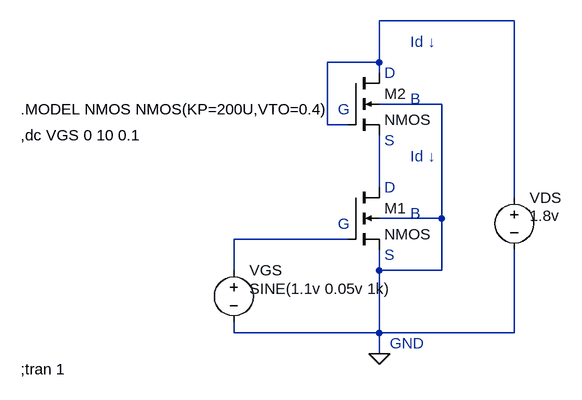
[diagram p0: schematic NMOS-NMOS.asc]
NMOS-NMOS.asc, the LTspice schematic file:
Version 4
SHEET 1 880 680
WIRE 336 -192 128 -192
WIRE 128 -128 128 -192
WIRE 128 -128 48 -128
WIRE 128 -112 128 -128
WIRE 224 -64 128 -64
WIRE 48 -32 48 -128
WIRE 80 -32 48 -32
WIRE 128 64 128 -16
WIRE 336 80 336 -192
WIRE 224 112 224 -64
WIRE 224 112 128 112
WIRE 80 144 -96 144
WIRE -96 192 -96 144
WIRE 128 192 128 160
WIRE 224 192 224 112
WIRE 224 192 128 192
WIRE -96 288 -96 272
WIRE 128 288 128 192
WIRE 128 288 -96 288
WIRE 336 288 336 160
WIRE 336 288 128 288
WIRE 128 320 128 288
FLAG 128 320 0
SYMBOL nmos4 80 64 R0
SYMATTR InstName M1
SYMATTR Value2 l=1u w=100u
SYMBOL voltage 336 64 R0
WINDOW 3 24 44 Left 2
WINDOW 123 0 0 Left 0
WINDOW 39 0 0 Left 0
SYMATTR Value 1.8v
SYMATTR InstName VDS
SYMBOL voltage -96 176 R0
WINDOW 3 24 44 Left 2
WINDOW 123 0 0 Left 0
WINDOW 39 0 0 Left 0
SYMATTR Value SINE(1.1v 0.05v 1k)
SYMATTR InstName VGS
SYMBOL nmos4 80 -112 R0
SYMATTR InstName M2
SYMATTR Value2 l=1u w=10u
TEXT 136 64 Left 2 ;D
TEXT 64 120 Left 2 ;G
TEXT 136 168 Left 2 ;S
TEXT 176 104 Left 2 ;B
TEXT 144 304 Left 2 ;GND
TEXT 176 16 Left 2 ;Id ↓
TEXT -424 -56 Left 2 !.MODEL NMOS NMOS(KP=200U,VTO=0.4)
TEXT -424 344 Left 2 !;tran 1
TEXT 136 -112 Left 2 ;D
TEXT 64 -56 Left 2 ;G
TEXT 136 -8 Left 2 ;S
TEXT 176 -72 Left 2 ;B
TEXT 176 -160 Left 2 ;Id ↓
TEXT -424 -16 Left 2 !,dc VGS 0 10 0.1

The netlist it stands for:
* NMOS-NMOS.asc
M1 N002 N003 0 0 NMOS l=1u w=100u
VDS N001 0 1.8v
VGS N003 0 SINE(1.1v 0.05v 1k)
M2 N001 N001 N002 0 NMOS l=1u w=10u
.model NMOS NMOS
.model PMOS PMOS
.lib standard.mos
* D
* G
* S
* B
* GND
* Id ↓
.MODEL NMOS NMOS(KP=200U,VTO=0.4)
;tran 1
* D
* G
* S
* B
* Id ↓
,dc VGS 0 10 0.1
.backanno
.end